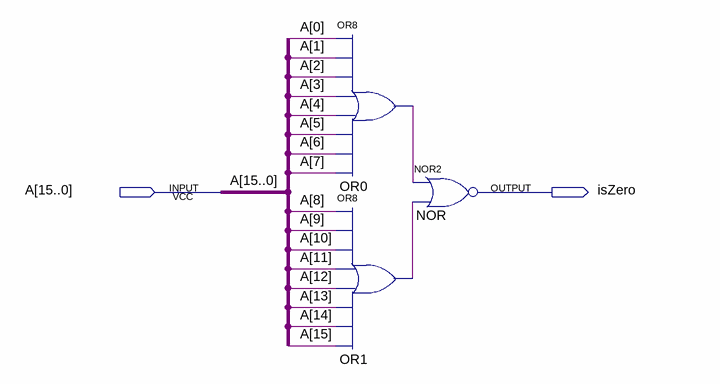
[diagram p0: schematic sheet]
// Quartus schematic isZero.bdf as structural Verilog: 3 symbols, 2 pins
module isZero (
  input  [15:0] A,
  output isZero
);

  wire OR0_out, OR1_out;

  or OR0 (OR0_out, A[0], A[1], A[2], A[3], A[4], A[5], A[6], A[7]);
  or OR1 (OR1_out, A[8], A[9], A[10], A[11], A[12], A[13], A[14], A[15]);
  nor NOR (isZero, OR0_out, OR1_out);
endmodule
